# Altium schematic sheet Peripherals.SchDoc
size 381 x 241 mm
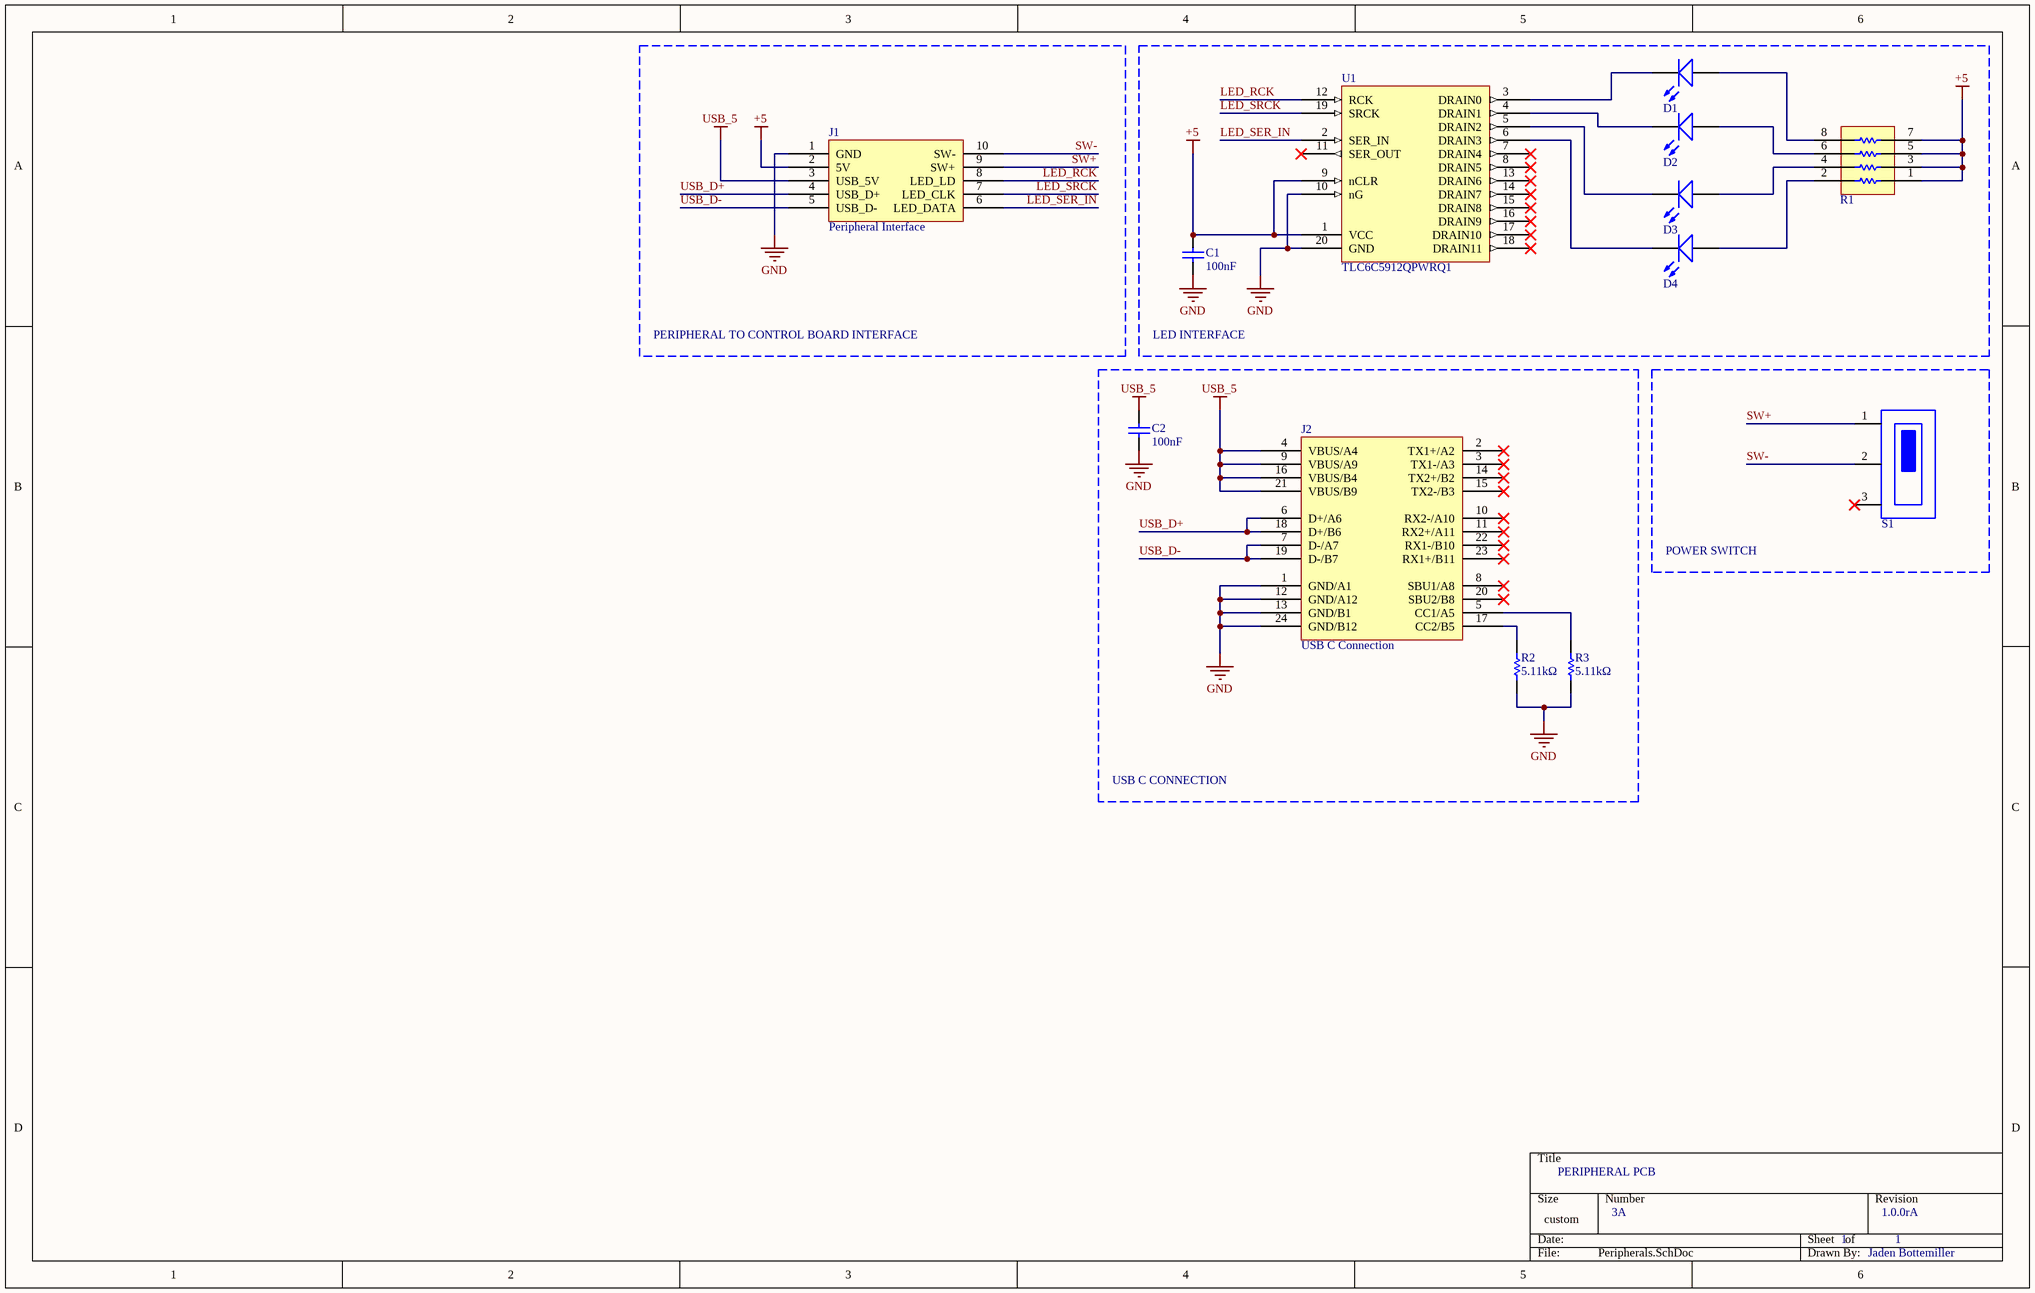
[diagram p0: Peripherals.SchDoc]

## Parts
C1  value 100nF  (hidden comment: CAP)
C2  value 100nF  (hidden comment: CAP)
D1  LED  (value not drawn)
D2  LED  (value not drawn)
D3  LED  (value not drawn)
D4  LED  (value not drawn)
J1  Peripheral Interface
J2  USB C Connection
R1  RESNET  (value not drawn)
R2  value 5.11kΩ  (hidden comment: RES)
R3  value 5.11kΩ  (hidden comment: RES)
S1  SPDT_SW  (value not drawn)
U1  TLC6C5912QPWRQ1

## Blocks framed on the sheet
PERIPHERAL TO CONTROL BOARD INTERFACE: J1
LED INTERFACE: C1 D1-D4 R1 U1
USB C CONNECTION: C2 J2 R2 R3
POWER SWITCH: S1

## Nets
+5: C1.2 J1.2(5V) R1.1(Pin) R1.3(Pin) R1.5(Pin) R1.7(Pin) U1.1(VCC) U1.9(nCLR)
GND: C1.1 C2.1 J1.1(GND) J2.1(GND/A1) J2.12(GND/A12) J2.13(GND/B1) J2.24(GND/B12) R2.1 R3.1 U1.10(nG) U1.20(GND)
USB_5: C2.2 J1.3(USB_5V) J2.4(VBUS/A4) J2.9(VBUS/A9) J2.16(VBUS/B4) J2.21(VBUS/B9)
LED_RCK: J1.8(LED_LD) U1.12(RCK)
LED_SER_IN: J1.6(LED_DATA) U1.2(SER_IN)
LED_SRCK: J1.7(LED_CLK) U1.19(SRCK)
SW+: J1.9(SW+) S1.1(Pin)
SW-: J1.10(SW-) S1.2(Pin)
USB_D+: J1.4(USB_D+) J2.6(D+/A6) J2.18(D+/B6)
USB_D-: J1.5(USB_D-) J2.7(D-/A7) J2.19(D-/B7)
NetD1_1: D1.1(K) U1.3(DRAIN0)
NetD1_2: D1.2(A) R1.8(Pin)
NetD2_1: D2.1(K) U1.4(DRAIN1)
NetD2_2: D2.2(A) R1.6(Pin)
NetD3_1: D3.1(K) U1.5(DRAIN2)
NetD3_2: D3.2(A) R1.4(Pin)
NetD4_1: D4.1(K) U1.6(DRAIN3)
NetD4_2: D4.2(A) R1.2(Pin)
NetJ2_5: J2.5(CC1/A5) R3.2
NetJ2_17: J2.17(CC2/B5) R2.2

Not connected (* = marked no-connect by the designer): J2 2(TX1+/A2)* 3(TX1-/A3)* 8(SBU1/A8)* 10(RX2-/A10)* 11(RX2+/A11)* 14(TX2+/B2)* 15(TX2-/B3)* 20(SBU2/B8)* 22(RX1-/B10)* 23(RX1+/B11)*; S1 3(Pin)*; U1 7(DRAIN4)* 8(DRAIN5)* 11(SER_OUT)* 13(DRAIN6)* 14(DRAIN7)* 15(DRAIN8)* 16(DRAIN9)* 17(DRAIN10)* 18(DRAIN11)*

## Notes on the sheet
- PERIPHERAL PCB
- 3A
- 1
- 1.0.0rA
- Jaden Bottemiller

## Library data of the parts
C1 C2 = CAP: Standard Capacitor
D1-D4 = LED: Standard LED
J1 = PERIPHERAL_INTERFACE: Interface between peripheral board and control board.
J2 = USBC_CONN: Standard USBC Connection
R1 = RESNET4: Standard Resistor Network with 4 Resistors
R2 R3 = RES: Standard Resistor
S1 = SPDT_SW: Standard Single-Pole Double-Throw Switch. Check pinning before assigning footprint.
U1 = TLC6C5912QPWRQ1: LED Driver IC 12 Output Linear Shift Register 50mA; ComponentLink1Description: DigiKey; ComponentLink1URL: https://www.digikey.com/product-detail/en/texas-instruments/TLC6C5912QPWRQ1/296-39249-1-ND/5143241; ComponentLink2Description: Datasheet; ComponentLink2URL: http://www.ti.com/lit/ds/symlink/tlc6c5912-q1.pdf